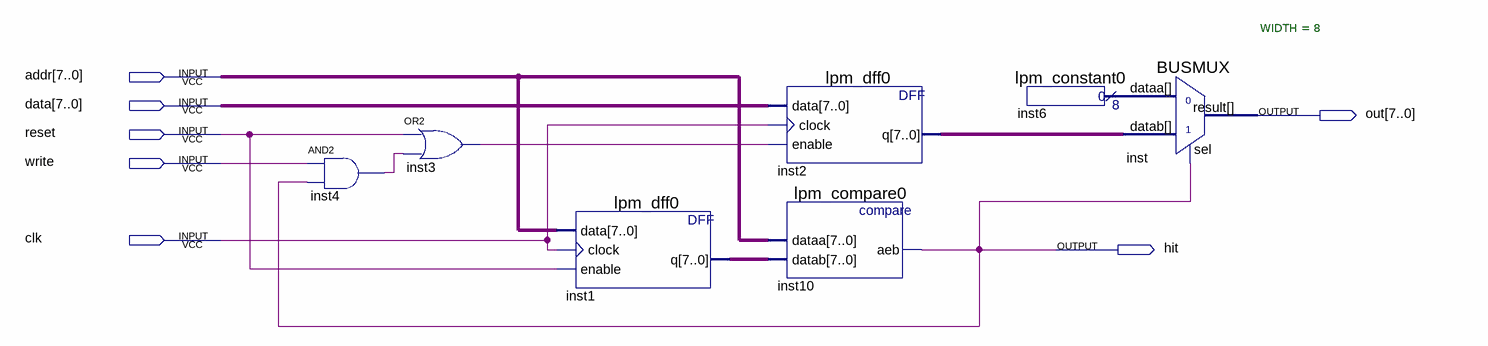
[diagram p0: schematic sheet]
// Quartus schematic cacheline.bdf as structural Verilog: 7 symbols, 7 pins
module cacheline (
  input  [7:0] addr,
  input  [7:0] data,
  input  reset,
  input  write,
  input  clk,
  output [7:0] out,
  output hit
);

  wire inst3_out, inst4_out;
  wire [7:0] inst1_q, inst2_q, inst6_result;

  and inst4 (inst4_out, write, hit);
  or inst3 (inst3_out, reset, inst4_out);
  lpm_dff0 inst1 (.data(addr), .clock(clk), .enable(reset), .q(inst1_q));
  lpm_dff0 inst2 (.data(data), .clock(clk), .enable(inst3_out), .q(inst2_q));
  lpm_compare0 inst10 (.dataa(addr), .datab(inst1_q), .aeb(hit));
  lpm_constant0 inst6 (.result(inst6_result));
  BUSMUX #(.WIDTH(8)) inst (.datab(inst2_q), .sel(hit), .dataa(inst6_result), .result(out));
endmodule
